# Altium schematic sheet FPGA.SchDoc: title
size A3; Author: NeoExiZ; CompanyName: BUPT CPS Lab; Engineer: NeoExiZ; Organization: NeoExiZ; Address1: 418, 4#Building,BUPT; Address2: No.10, Xitucheng Road; Address3: Beijing; Address4: China
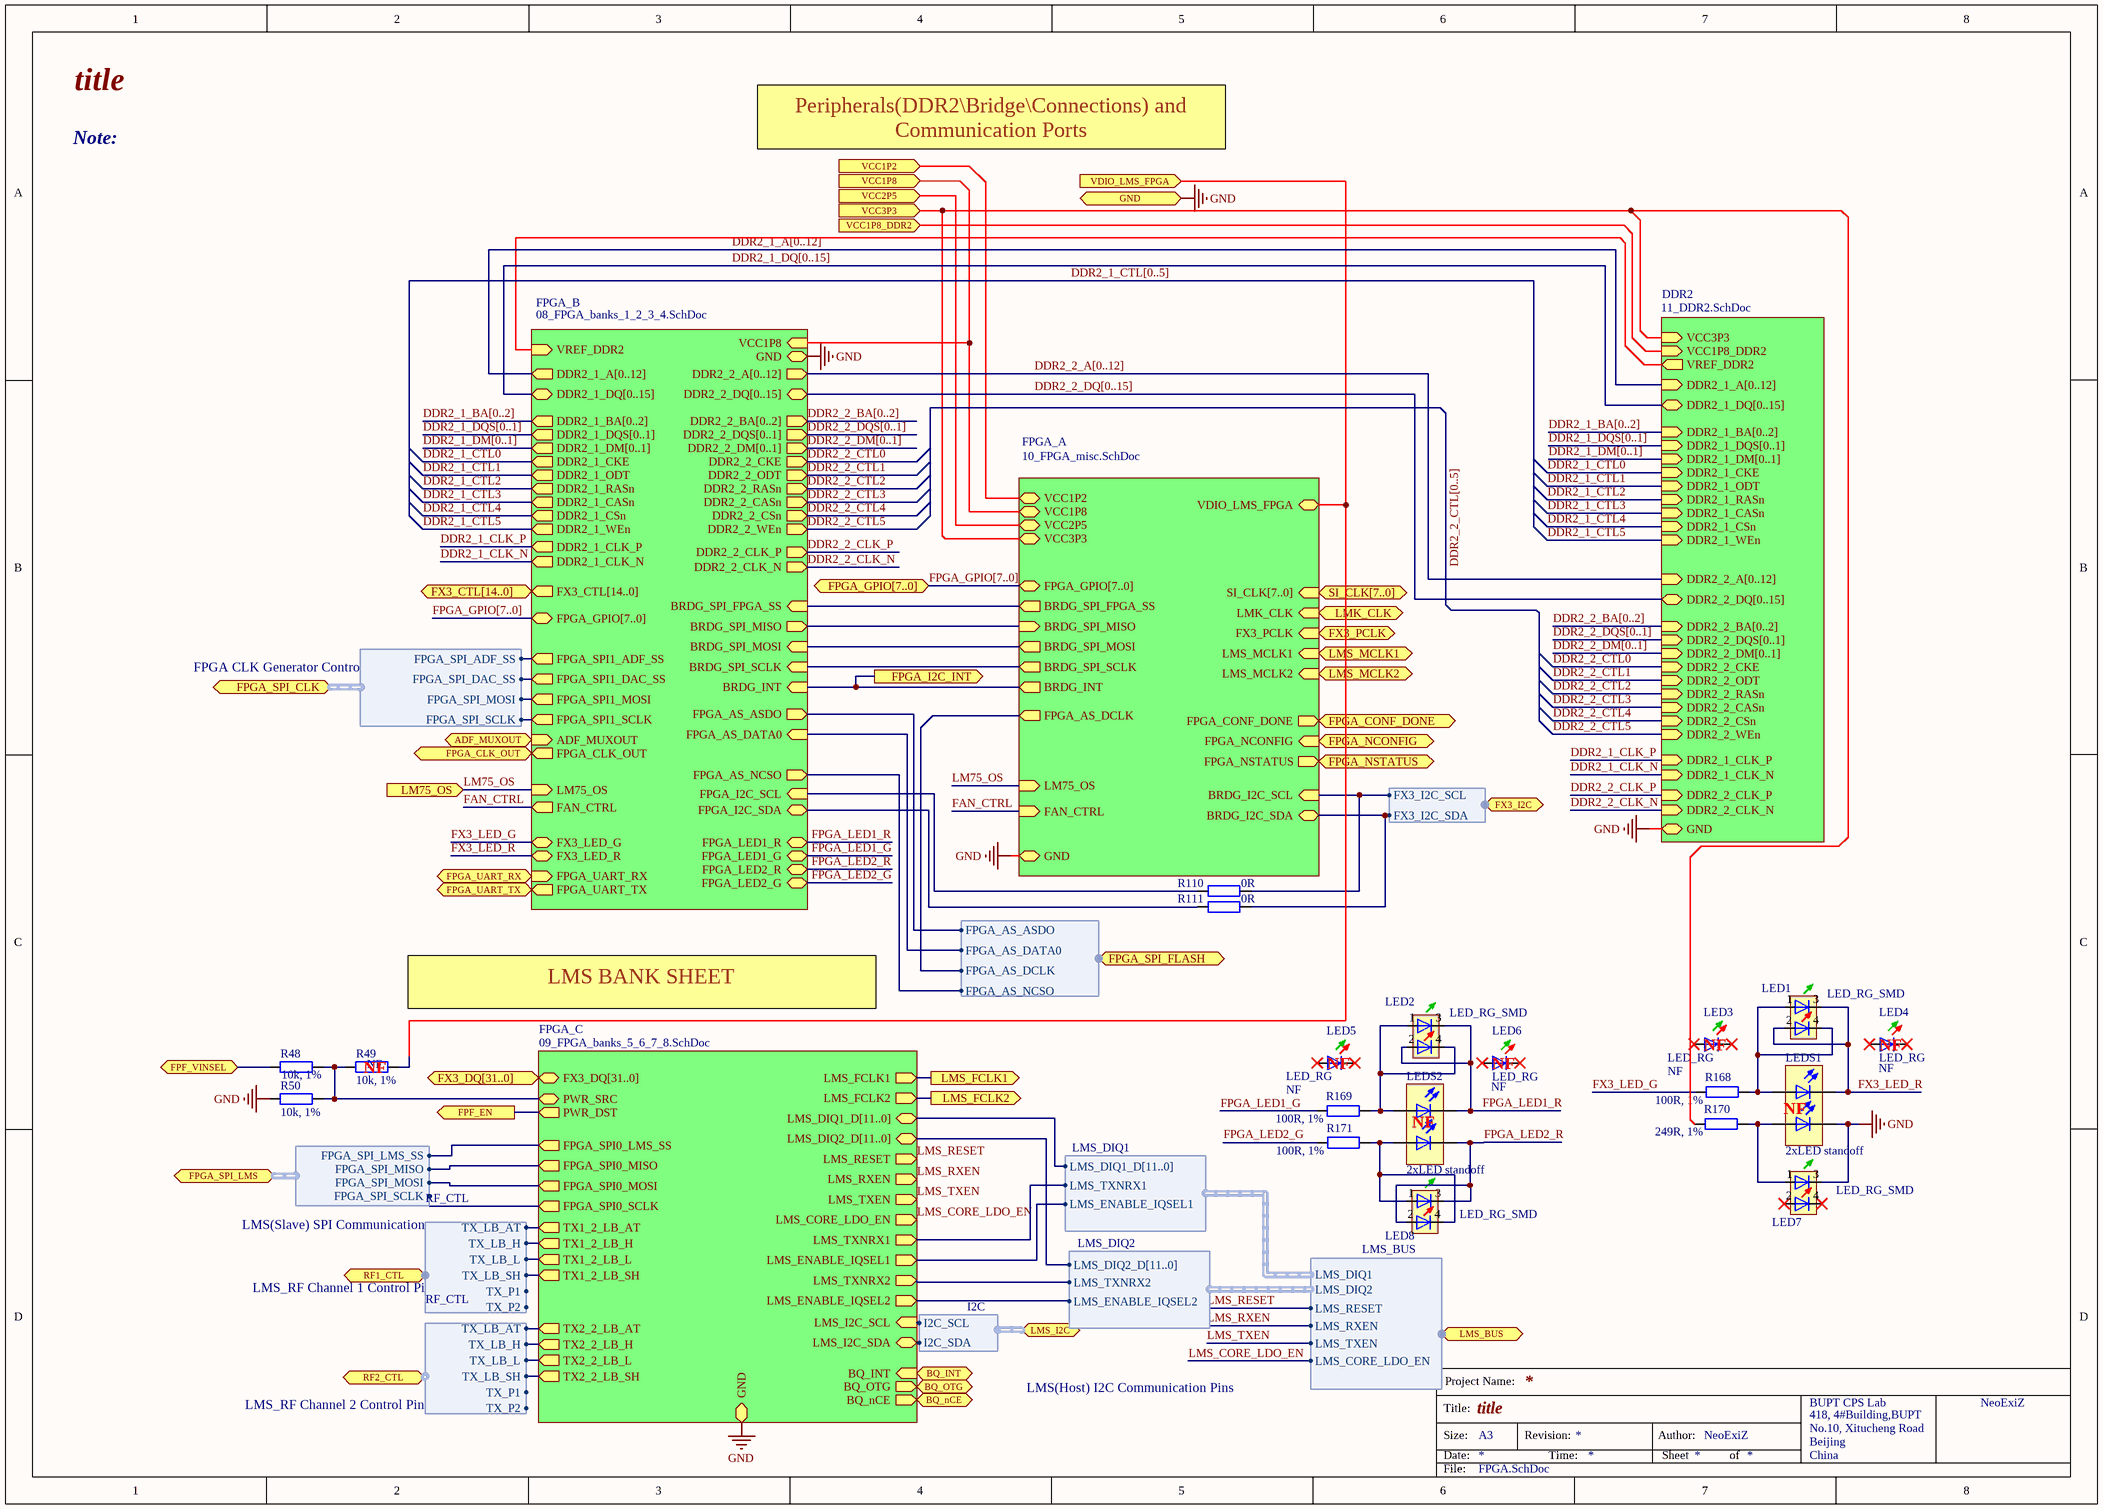
[diagram p0: FPGA.SchDoc]

## Parts
LED1  LED_RG_SMD  [LED-2x0603]
LED2  LED_RG_SMD  [LED-2x0603]
LED3  LED_RG  Assembly Info: NF  (mechanical)
LED4  LED_RG  Assembly Info: NF  (mechanical)
LED5  LED_RG  Assembly Info: NF  (mechanical)
LED6  LED_RG  Assembly Info: NF  (mechanical)
LED7  LED_RG_SMD  [LED-2x0603]
LED8  LED_RG_SMD  [LED-2x0603]
LEDS1  2xLED standoff  [LED_STANDOFF_H-201C]
LEDS2  2xLED standoff  [LED_STANDOFF_H-201C]
R48  10k, 1%  [RES0402]
R49  10k, 1%  Assembly Info: NF  [RES0402]
R50  10k, 1%  [RES0402]
R110  0R  [RES0402]
R111  0R  [RES0402]
R168  100R, 1%  [RES0402]
R169  100R, 1%  [RES0402]
R170  249R, 1%  [RES0402]
R171  100R, 1%  [RES0402]

## Sub-sheets
DDR2 = 11_DDR2.SchDoc: DDR2_1_ODT (in), DDR2_1_RASn (in), DDR2_1_WEn (in), DDR2_1_CKE (in), DDR2_1_CSn (in), DDR2_1_CASn (in), DDR2_1_BA[0..2] (in), DDR2_1_DM[0..1] (in), DDR2_1_DQS[0..1] (in), DDR2_1_A[0..12] (in), DDR2_1_DQ[0..15] (bidir), VCC1P8_DDR2 (in), VCC3P3 (in), VREF_DDR2 (out), DDR2_2_BA[0..2] (in), DDR2_2_CASn (in), DDR2_2_CKE (in), DDR2_2_CSn (in), DDR2_2_ODT (in), DDR2_2_RASn (in), DDR2_2_WEn (in), DDR2_2_DM[0..1] (in), DDR2_2_DQS[0..1] (in), DDR2_2_DQ[0..15] (bidir), DDR2_2_A[0..12] (in), DDR2_1_CLK_P (in), DDR2_1_CLK_N (in), DDR2_2_CLK_N (in), DDR2_2_CLK_P (in), GND
FPGA_A = 10_FPGA_misc.SchDoc: FX3_PCLK (in), SI_CLK[7..0] (in), FPGA_GPIO[7..0] (bidir), LMK_CLK (in), LMS_MCLK1 (in), LMS_MCLK2 (in), FPGA_AS_DCLK (out), FPGA_CONF_DONE (out), FPGA_NCONFIG (in), FPGA_NSTATUS (out), BRDG_SPI_FPGA_SS (out), BRDG_SPI_MISO (in), BRDG_SPI_MOSI (out), BRDG_SPI_SCLK (out), BRDG_INT (out), BRDG_I2C_SCL (in), BRDG_I2C_SDA (bidir), LM75_OS (in), FAN_CTRL (in), VCC1P2, VCC1P8, VCC3P3, VDIO_LMS_FPGA, VCC2P5, GND
FPGA_B = 08_FPGA_banks_1_2_3_4.SchDoc: FX3_CTL[14..0] (out), FPGA_GPIO[7..0] (bidir), BRDG_INT (in), BRDG_SPI_FPGA_SS (in), BRDG_SPI_MISO (out), BRDG_SPI_MOSI (in), BRDG_SPI_SCLK (in), FPGA_SPI1_ADF_SS (out), FPGA_SPI1_DAC_SS (out), FPGA_SPI1_MOSI (out), FPGA_SPI1_SCLK (out), FPGA_CLK_OUT (out), FPGA_AS_ASDO (out), FPGA_AS_DATA0 (in), FPGA_AS_NCSO (out), LM75_OS (in), FAN_CTRL (out), FPGA_I2C_SCL (in), FPGA_I2C_SDA (bidir), DDR2_1_ODT (out), DDR2_1_RASn (out), DDR2_1_WEn (out), DDR2_2_BA[0..2] (out), DDR2_2_CASn (out), DDR2_2_CKE (out), DDR2_2_CSn (out), DDR2_2_ODT (out), DDR2_2_RASn (out), DDR2_2_WEn (out), DDR2_1_CKE (out), DDR2_1_CSn (out), DDR2_1_CASn (out), DDR2_1_BA[0..2] (out), DDR2_1_DM[0..1] (out), DDR2_2_DM[0..1] (out), DDR2_2_DQS[0..1] (out), DDR2_1_DQS[0..1] (out), DDR2_1_A[0..12] (out), DDR2_1_DQ[0..15] (bidir), DDR2_2_DQ[0..15] (bidir), DDR2_2_A[0..12] (out), VREF_DDR2 (in), DDR2_2_CLK_N (out), DDR2_2_CLK_P (out), DDR2_1_CLK_N (out), DDR2_1_CLK_P (out), FPGA_LED1_R, FPGA_LED1_G, FPGA_LED2_G, FPGA_LED2_R, FX3_LED_G, FX3_LED_R, FPGA_UART_RX (in), FPGA_UART_TX (out), ADF_MUXOUT (in), VCC1P8 (in), GND
FPGA_C = 09_FPGA_banks_5_6_7_8.SchDoc: FX3_DQ[31..0] (bidir), LMS_FCLK2 (out), LMS_FCLK1 (out), LMS_DIQ1_D[11..0] (bidir), LMS_DIQ2_D[11..0] (bidir), FPGA_SPI0_MISO (out), FPGA_SPI0_MOSI (out), FPGA_SPI0_SCLK (out), FPGA_SPI0_LMS_SS (out), LMS_RESET (out), LMS_RXEN (out), LMS_TXEN (out), LMS_TXNRX1 (out), LMS_TXNRX2 (out), LMS_ENABLE_IQSEL1 (out), LMS_ENABLE_IQSEL2 (out), LMS_CORE_LDO_EN (out), LMS_I2C_SCL (in), LMS_I2C_SDA (bidir), TX1_2_LB_AT (out), TX1_2_LB_H (out), TX1_2_LB_L (out), TX1_2_LB_SH (out), TX2_2_LB_AT (out), TX2_2_LB_H (out), TX2_2_LB_L (out), TX2_2_LB_SH (out), PWR_SRC (bidir), GND, BQ_nCE (out), BQ_OTG (out), BQ_INT (in), PWR_DST (out)

## Ports
ADF_MUXOUT (in), BQ_INT (in), BQ_nCE (out), BQ_OTG (out), FPF_EN (out), FPF_VINSEL (bidir), FPGA_CLK_OUT (out), FPGA_CONF_DONE (out), FPGA_GPIO[7..0] (bidir), FPGA_I2C_INT (out), FPGA_NCONFIG (in), FPGA_NSTATUS (out), FPGA_SPI_CLK (harness FPGA_SPI_CLK), FPGA_SPI_FLASH (harness FPGA_SPI_FLASH), FPGA_SPI_LMS (harness FPGA_SPI_LMS), FPGA_UART_RX (in), FPGA_UART_TX (out), FX3_CTL[14..0] (out), FX3_DQ[31..0] (bidir), FX3_I2C (harness FX3_I2C), FX3_PCLK (in), GND, LM75_OS (in), LMK_CLK (in), LMS_BUS (harness LMS_BUS), LMS_FCLK1 (out), LMS_FCLK2 (out), LMS_I2C (harness I2C), LMS_MCLK1 (in), LMS_MCLK2 (in), RF1_CTL (harness RF_CTL), RF2_CTL (harness RF_CTL), SI_CLK[7..0] (in), VCC1P2 (in), VCC1P8 (in), VCC1P8_DDR2 (in), VCC2P5 (in), VCC3P3 (in), VDIO_LMS_FPGA (in)

## Harnesses
FPGA_SPI_CLK: FPGA_SPI_SCLK, FPGA_SPI_MOSI, FPGA_SPI_DAC_SS, FPGA_SPI_ADF_SS
FX3_I2C: FX3_I2C_SCL, FX3_I2C_SDA
FPGA_SPI_FLASH: FPGA_AS_ASDO, FPGA_AS_DATA0, FPGA_AS_DCLK, FPGA_AS_NCSO
FPGA_SPI_LMS: FPGA_SPI_LMS_SS, FPGA_SPI_MISO, FPGA_SPI_MOSI, FPGA_SPI_SCLK
I2C: I2C_SCL, I2C_SDA
LMS_DIQ1: LMS_DIQ1_D[11..0], LMS_TXNRX1, LMS_ENABLE_IQSEL1
LMS_DIQ2: LMS_DIQ2_D[11..0], LMS_TXNRX2, LMS_ENABLE_IQSEL2
LMS_BUS: LMS_DIQ1, LMS_DIQ2, LMS_RESET, LMS_RXEN, LMS_TXEN, LMS_CORE_LDO_EN
RF_CTL: TX_LB_AT, TX_LB_H, TX_LB_L, TX_LB_SH, TX_P1, TX_P2

## Nets
GND: LED7.3 LEDS1.K2(C) R50.1 ; port GND, sheet FPGA_C/GND, sheet FPGA_B/GND, sheet FPGA_A/GND, sheet DDR2/GND
ADF_MUXOUT: port ADF_MUXOUT, sheet FPGA_B/ADF_MUXOUT
BQ_INT: port BQ_INT, sheet FPGA_C/BQ_INT
BQ_nCE: port BQ_nCE, sheet FPGA_C/BQ_nCE
BQ_OTG: port BQ_OTG, sheet FPGA_C/BQ_OTG
DDR2_1_CLK_N: sheet FPGA_B/DDR2_1_CLK_N, sheet DDR2/DDR2_1_CLK_N
DDR2_1_CLK_P: sheet FPGA_B/DDR2_1_CLK_P, sheet DDR2/DDR2_1_CLK_P
DDR2_1_CTL0: sheet FPGA_B/DDR2_1_CKE, sheet DDR2/DDR2_1_CKE
DDR2_1_CTL1: sheet FPGA_B/DDR2_1_ODT, sheet DDR2/DDR2_1_ODT
DDR2_1_CTL2: sheet FPGA_B/DDR2_1_RASn, sheet DDR2/DDR2_1_RASn
DDR2_1_CTL3: sheet FPGA_B/DDR2_1_CASn, sheet DDR2/DDR2_1_CASn
DDR2_1_CTL4: sheet FPGA_B/DDR2_1_CSn, sheet DDR2/DDR2_1_CSn
DDR2_1_CTL5: sheet FPGA_B/DDR2_1_WEn, sheet DDR2/DDR2_1_WEn
DDR2_2_CLK_N: sheet FPGA_B/DDR2_2_CLK_N, sheet DDR2/DDR2_2_CLK_N
DDR2_2_CLK_P: sheet FPGA_B/DDR2_2_CLK_P, sheet DDR2/DDR2_2_CLK_P
DDR2_2_CTL0: sheet FPGA_B/DDR2_2_CKE, sheet DDR2/DDR2_2_CKE
DDR2_2_CTL1: sheet FPGA_B/DDR2_2_ODT, sheet DDR2/DDR2_2_ODT
DDR2_2_CTL2: sheet FPGA_B/DDR2_2_RASn, sheet DDR2/DDR2_2_RASn
DDR2_2_CTL3: sheet FPGA_B/DDR2_2_CASn, sheet DDR2/DDR2_2_CASn
DDR2_2_CTL4: sheet FPGA_B/DDR2_2_CSn, sheet DDR2/DDR2_2_CSn
DDR2_2_CTL5: sheet FPGA_B/DDR2_2_WEn, sheet DDR2/DDR2_2_WEn
FAN_CTRL: sheet FPGA_B/FAN_CTRL, sheet FPGA_A/FAN_CTRL
FPF_EN: port FPF_EN, sheet FPGA_C/PWR_DST
FPF_VINSEL: R48.1 ; port FPF_VINSEL
FPGA_CLK_OUT: port FPGA_CLK_OUT, sheet FPGA_B/FPGA_CLK_OUT
FPGA_CONF_DONE: port FPGA_CONF_DONE, sheet FPGA_A/FPGA_CONF_DONE
FPGA_I2C_INT: port FPGA_I2C_INT, sheet FPGA_B/BRDG_INT, sheet FPGA_A/BRDG_INT
FPGA_LED1_G: R169.1 ; sheet FPGA_B/FPGA_LED1_G
FPGA_LED1_R: LED2.2 LED2.3 LEDS2.K1(C) ; sheet FPGA_B/FPGA_LED1_R
FPGA_LED2_G: R171.1 ; sheet FPGA_B/FPGA_LED2_G
FPGA_LED2_R: LED8.2 LED8.3 LEDS2.K2(C) ; sheet FPGA_B/FPGA_LED2_R
FPGA_NCONFIG: port FPGA_NCONFIG, sheet FPGA_A/FPGA_NCONFIG
FPGA_NSTATUS: port FPGA_NSTATUS, sheet FPGA_A/FPGA_NSTATUS
FPGA_UART_RX: port FPGA_UART_RX, sheet FPGA_B/FPGA_UART_RX
FPGA_UART_TX: port FPGA_UART_TX, sheet FPGA_B/FPGA_UART_TX
FX3_LED_G: R168.1 ; sheet FPGA_B/FX3_LED_G
FX3_LED_R: LED1.2 LED1.3 LEDS1.K1(C) ; sheet FPGA_B/FX3_LED_R
FX3_PCLK: port FX3_PCLK, sheet FPGA_A/FX3_PCLK
LM75_OS: port LM75_OS, sheet FPGA_B/LM75_OS, sheet FPGA_A/LM75_OS
LMK_CLK: port LMK_CLK, sheet FPGA_A/LMK_CLK
LMS_CORE_LDO_EN: sheet FPGA_C/LMS_CORE_LDO_EN, port LMS_BUS.LMS_CORE_LDO_EN
LMS_FCLK1: port LMS_FCLK1, sheet FPGA_C/LMS_FCLK1
LMS_FCLK2: port LMS_FCLK2, sheet FPGA_C/LMS_FCLK2
LMS_MCLK1: port LMS_MCLK1, sheet FPGA_A/LMS_MCLK1
LMS_MCLK2: port LMS_MCLK2, sheet FPGA_A/LMS_MCLK2
LMS_RESET: sheet FPGA_C/LMS_RESET, port LMS_BUS.LMS_RESET
LMS_RXEN: sheet FPGA_C/LMS_RXEN, port LMS_BUS.LMS_RXEN
LMS_TXEN: sheet FPGA_C/LMS_TXEN, port LMS_BUS.LMS_TXEN
VCC1P2: port VCC1P2, sheet FPGA_A/VCC1P2
VCC1P8: port VCC1P8, sheet FPGA_B/VCC1P8, sheet FPGA_A/VCC1P8
VCC1P8_DDR2: port VCC1P8_DDR2, sheet DDR2/VCC1P8_DDR2
VCC2P5: port VCC2P5, sheet FPGA_A/VCC2P5
VCC3P3: R170.1 ; port VCC3P3, sheet FPGA_A/VCC3P3, sheet DDR2/VCC3P3
VDIO_LMS_FPGA: R49.2 ; port VDIO_LMS_FPGA, sheet FPGA_A/VDIO_LMS_FPGA
NetLED1_1: LED1.1 LED1.4 LEDS1.A1(A) R168.2
NetLED2_1: LED2.1 LED2.4 LEDS2.A1(A) R169.2
NetLED7_1: LED7.1 LEDS1.A2(A) R170.2
NetLED8_1: LED8.1 LED8.4 LEDS2.A2(A) R171.2
NetR48_2: R48.2 R49.1 R50.2 ; sheet FPGA_C/PWR_SRC
NetR110_1: R110.1 ; sheet FPGA_B/FPGA_I2C_SCL
NetR110_2: R110.2 ; sheet FPGA_A/BRDG_I2C_SCL, port FX3_I2C.FX3_I2C_SCL
NetR111_1: R111.1 ; sheet FPGA_B/FPGA_I2C_SDA
NetR111_2: R111.2 ; sheet FPGA_A/BRDG_I2C_SDA, port FX3_I2C.FX3_I2C_SDA
(unnamed): sheet FPGA_C/FPGA_SPI0_MISO, port FPGA_SPI_LMS.FPGA_SPI_MISO
(unnamed): sheet FPGA_C/FPGA_SPI0_MOSI, port FPGA_SPI_LMS.FPGA_SPI_MOSI
(unnamed): sheet FPGA_C/FPGA_SPI0_SCLK, port FPGA_SPI_LMS.FPGA_SPI_SCLK
(unnamed): sheet FPGA_C/FPGA_SPI0_LMS_SS, port FPGA_SPI_LMS.FPGA_SPI_LMS_SS
(unnamed): sheet FPGA_C/LMS_TXNRX1, harness LMS_DIQ1.LMS_TXNRX1
(unnamed): sheet FPGA_C/LMS_TXNRX2, harness LMS_DIQ2.LMS_TXNRX2
(unnamed): sheet FPGA_C/LMS_ENABLE_IQSEL1, harness LMS_DIQ1.LMS_ENABLE_IQSEL1
(unnamed): sheet FPGA_C/LMS_ENABLE_IQSEL2, harness LMS_DIQ2.LMS_ENABLE_IQSEL2
(unnamed): sheet FPGA_C/LMS_I2C_SCL, port LMS_I2C.I2C_SCL
(unnamed): sheet FPGA_C/LMS_I2C_SDA, port LMS_I2C.I2C_SDA
(unnamed): sheet FPGA_C/TX1_2_LB_AT, port RF1_CTL.TX_LB_AT
(unnamed): sheet FPGA_C/TX1_2_LB_H, port RF1_CTL.TX_LB_H
(unnamed): sheet FPGA_C/TX1_2_LB_L, port RF1_CTL.TX_LB_L
(unnamed): sheet FPGA_C/TX1_2_LB_SH, port RF1_CTL.TX_LB_SH
(unnamed): sheet FPGA_C/TX2_2_LB_AT, port RF2_CTL.TX_LB_AT
(unnamed): sheet FPGA_C/TX2_2_LB_H, port RF2_CTL.TX_LB_H
(unnamed): sheet FPGA_C/TX2_2_LB_L, port RF2_CTL.TX_LB_L
(unnamed): sheet FPGA_C/TX2_2_LB_SH, port RF2_CTL.TX_LB_SH
(unnamed): sheet FPGA_B/BRDG_SPI_FPGA_SS, sheet FPGA_A/BRDG_SPI_FPGA_SS
(unnamed): sheet FPGA_B/BRDG_SPI_MISO, sheet FPGA_A/BRDG_SPI_MISO
(unnamed): sheet FPGA_B/BRDG_SPI_MOSI, sheet FPGA_A/BRDG_SPI_MOSI
(unnamed): sheet FPGA_B/BRDG_SPI_SCLK, sheet FPGA_A/BRDG_SPI_SCLK
(unnamed): sheet FPGA_B/FPGA_SPI1_ADF_SS, port FPGA_SPI_CLK.FPGA_SPI_ADF_SS
(unnamed): sheet FPGA_B/FPGA_SPI1_DAC_SS, port FPGA_SPI_CLK.FPGA_SPI_DAC_SS
(unnamed): sheet FPGA_B/FPGA_SPI1_MOSI, port FPGA_SPI_CLK.FPGA_SPI_MOSI
(unnamed): sheet FPGA_B/FPGA_SPI1_SCLK, port FPGA_SPI_CLK.FPGA_SPI_SCLK
(unnamed): sheet FPGA_B/FPGA_AS_ASDO, port FPGA_SPI_FLASH.FPGA_AS_ASDO
(unnamed): sheet FPGA_B/FPGA_AS_DATA0, port FPGA_SPI_FLASH.FPGA_AS_DATA0
(unnamed): sheet FPGA_B/FPGA_AS_NCSO, port FPGA_SPI_FLASH.FPGA_AS_NCSO
(unnamed): sheet FPGA_B/VREF_DDR2, sheet DDR2/VREF_DDR2
(unnamed): sheet FPGA_A/FPGA_AS_DCLK, port FPGA_SPI_FLASH.FPGA_AS_DCLK

Not connected (* = marked no-connect by the designer): LED3 A* K(C)*; LED4 A* K(C)*; LED5 A* K(C)*; LED6 A* K(C)*; LED7 2* 4*

## Buses and harness runs
bus DDR2_1_A[0..12] = sheet DDR2/DDR2_1_A[0..12] = sheet FPGA_B/DDR2_1_A[0..12]
bus DDR2_1_BA[0..2] = sheet DDR2/DDR2_1_BA[0..2]
bus DDR2_1_BA[0..2] = sheet FPGA_B/DDR2_1_BA[0..2]
bus DDR2_1_CTL[0..5]
bus DDR2_1_DM[0..1] = sheet DDR2/DDR2_1_DM[0..1]
bus DDR2_1_DM[0..1] = sheet FPGA_B/DDR2_1_DM[0..1]
bus DDR2_1_DQ[0..15] = sheet DDR2/DDR2_1_DQ[0..15] = sheet FPGA_B/DDR2_1_DQ[0..15]
bus DDR2_1_DQS[0..1] = sheet DDR2/DDR2_1_DQS[0..1]
bus DDR2_1_DQS[0..1] = sheet FPGA_B/DDR2_1_DQS[0..1]
bus DDR2_2_A[0..12] = sheet DDR2/DDR2_2_A[0..12] = sheet FPGA_B/DDR2_2_A[0..12]
bus DDR2_2_BA[0..2] = sheet DDR2/DDR2_2_BA[0..2]
bus DDR2_2_BA[0..2] = sheet FPGA_B/DDR2_2_BA[0..2]
bus DDR2_2_CTL[0..5]
bus DDR2_2_DM[0..1] = sheet DDR2/DDR2_2_DM[0..1]
bus DDR2_2_DM[0..1] = sheet FPGA_B/DDR2_2_DM[0..1]
bus DDR2_2_DQ[0..15] = sheet DDR2/DDR2_2_DQ[0..15] = sheet FPGA_B/DDR2_2_DQ[0..15]
bus DDR2_2_DQS[0..1] = sheet DDR2/DDR2_2_DQS[0..1]
bus DDR2_2_DQS[0..1] = sheet FPGA_B/DDR2_2_DQS[0..1]
bus FPGA_GPIO[7..0] = port FPGA_GPIO[7..0] = sheet FPGA_A/FPGA_GPIO[7..0]
bus FPGA_GPIO[7..0] = sheet FPGA_B/FPGA_GPIO[7..0]
bus port FX3_CTL[14..0] = sheet FPGA_B/FX3_CTL[14..0]
bus port FX3_DQ[31..0] = sheet FPGA_C/FX3_DQ[31..0]
bus port SI_CLK[7..0] = sheet FPGA_A/SI_CLK[7..0]

## Notes on the sheet
- Peripherals(DDR2\Bridge\Connections) and Communication Ports
- FPGA CLK Generator Control
- LMS BANK SHEET
- (near LED3) NF
- (near LED4) NF
- (near R49) NF
- (near LED5) NF
- (near LEDS2) NF
- (near LED6) NF
- (near LEDS1) NF
- LMS(Slave) SPI Communication
- LMS_RF Channel 1 Control Pin
- LMS(Host) I2C Communication Pins
- LMS_RF Channel 2 Control Pin
- Note:
- Project Name:
- Size:
- Date:
- Title:
- A3
- Revision:
- Time:
- Author:
- Sheet
- of
- File:

## Library data of the parts
LED1 LED2 LED7 LED8 = LED_green_red_SMD: Manufacturer Part Number 1: HSMF-C165; Manufacturer: Avago Technologies US Inc.; Part Description: LED GREEN/RED DIFFUSED 0603 SMD; Millicandela Rating: 15mcd Green, 10mcd Red; Lens Transparency: Diffused; Lens Color: White; Lens Style/Size: Rectangle with Flat Top, 1.60mm x 0.80mm; Wavelength - Peak: 570nm Green, 636nm Red; Wavelength - Dominant: 572nm Green, 621nm Red; Viewing Angle: 120°; Voltage - Forward (Vf) (Typ): 2.2V Green, 1.95V Red; Current - Test: 20mA; Color: Green, Red; Supplier 1: Digi-Key; Height (Max): 0.50mm; Packaging: Cut Tape (CT); Category: Optoelectronics; Mounting Type: Surface Mount; Package / Case: 0603 (1608 Metric); Size / Dimension: 1.60mm L x 0.80mm W; Supplier Device Package: *; RoHS: RoHS Compliant; Supplier Part Number 1: 516-1419-1-ND
LED3-LED6 = LED_green_red: Manufacturer Part Number 1: 4301F1/5; Manufacturer: Visual Communications Company - VCC; Part Description: LED GRN/RED DIFF 3MM ROUND T/H; Voltage - Forward (Vf) (Typ): 2.1V Green, 1.8V Red; Lens Color: White; Lens Style/Size: Round with Domed Top, 3mm (T-1), 2.90mm; Millicandela Rating: 12.6mcd Green, 3.7mcd Red; Color: Green, Red; Viewing Angle: 100°; Lens Transparency: Diffused; Current - Test: 20mA Green, 20mA Red; Wavelength - Peak: 565nm Green, 660nm Red; Supplier 1: Digi-Key; Supplier Part Number 1: 4301F1/5-ND; RoHS: RoHS Compliant; Packaging: Bulk; Package / Case: Radial; Mounting Type: Through Hole; Wavelength - Dominant: -; Supplier Device Package: T-1; Size / Dimension: -; Category: Optoelectronics; Height (Max): 5.44mm
LEDS1 LEDS2 = LEDx2_STANDOFF
R48-R50 = Res_0402: Manufacturer: Yageo; Manufacturer Part Number 1: RC0402FR-0710KL; Part Description: RES SMD 10K OHM 1% 1/16W 0402; Temperature Coefficient: ±100ppm/°C; Power (Watts): 0.063W, 1/16W; Value: 10k, 1%; Supplier 1: Digi-Key; Supplier Part Number 1: 311-10.0KLRTR-ND; Resistance (Ohms): 10k; Packaging: Tape & Reel (TR); RoHS: RoHS Compliant; Package / Case: 0402 (1005 Metric); Tolerance: ±1%; Operating Temperature: -55°C ~ 155°C; Size / Dimension: 0.039" L x 0.020" W (1.00mm x 0.50mm); Number of Terminations: 2; Category: Resistors; Height: 0.016" (0.40mm); Supplier Device Package: 0402; Features: Moisture Resistant; Composition: Thick Film
R110 R111 = Res_0402: Manufacturer: Yageo; Part Description: RES SMD 0.0OHM JUMPER 1/16W 0402; Supplier 1: Digi-Key; Supplier Part Number 1: 311-0.0JRTR-ND; Composition: Thick Film; Package / Case: 0402 (1005 Metric); Category: Resistors; Value: 0R
R168 R169 R171 = Res_0402: Manufacturer Part Number 1: RMCF0402FT100R; Manufacturer: Stackpole Electronics Inc.; Part Description: RES SMD 100 OHM 1% 1/16W 0402; Power (Watts): 0.063W, 1/16W; Temperature Coefficient: ±100ppm/°C; Resistance (Ohms): 100; Value: 100R, 1%; Supplier 1: Digi-Key; Supplier Part Number 1: RMCF0402FT100RDKR-ND; Packaging: Digi-Reel®; Composition: Thick Film; Number of Terminations: 2; Package / Case: 0402 (1005 Metric); RoHS: RoHS Compliant; Category: Resistors; Size / Dimension: 0.039" L x 0.020" W (1.00mm x 0.50mm); Tolerance: ±1%; Supplier Device Package: 0402; Features: -; Height: 0.016" (0.40mm); Operating Temperature: -55°C ~ 155°C
R170 = Res_0402: Manufacturer Part Number 1: RMCF0402FT249R; Manufacturer: Stackpole Electronics Inc; Part Description: RES SMD 249 OHM 1% 1/16W 0402; Resistance (Ohms): 249; Power (Watts): 0.063W, 1/16W; Temperature Coefficient: ±100ppm/°C; Value: 249R, 1%; Supplier 1: Digi-Key; Supplier Part Number 1: RMCF0402FT249RCT-ND; Package / Case: 0402 (1005 Metric); Features: -; Size / Dimension: 0.039" L x 0.020" W (1.00mm x 0.50mm); Category: Resistors; Operating Temperature: -55°C ~ 155°C; Packaging: Cut Tape (CT); Tolerance: ±1%; Supplier Device Package: 0402; RoHS: RoHS Compliant; Composition: Thick Film; Number of Terminations: 2; Height: 0.016" (0.40mm)